# Altium schematic sheet p4_thresolts.SchDoc
size A4
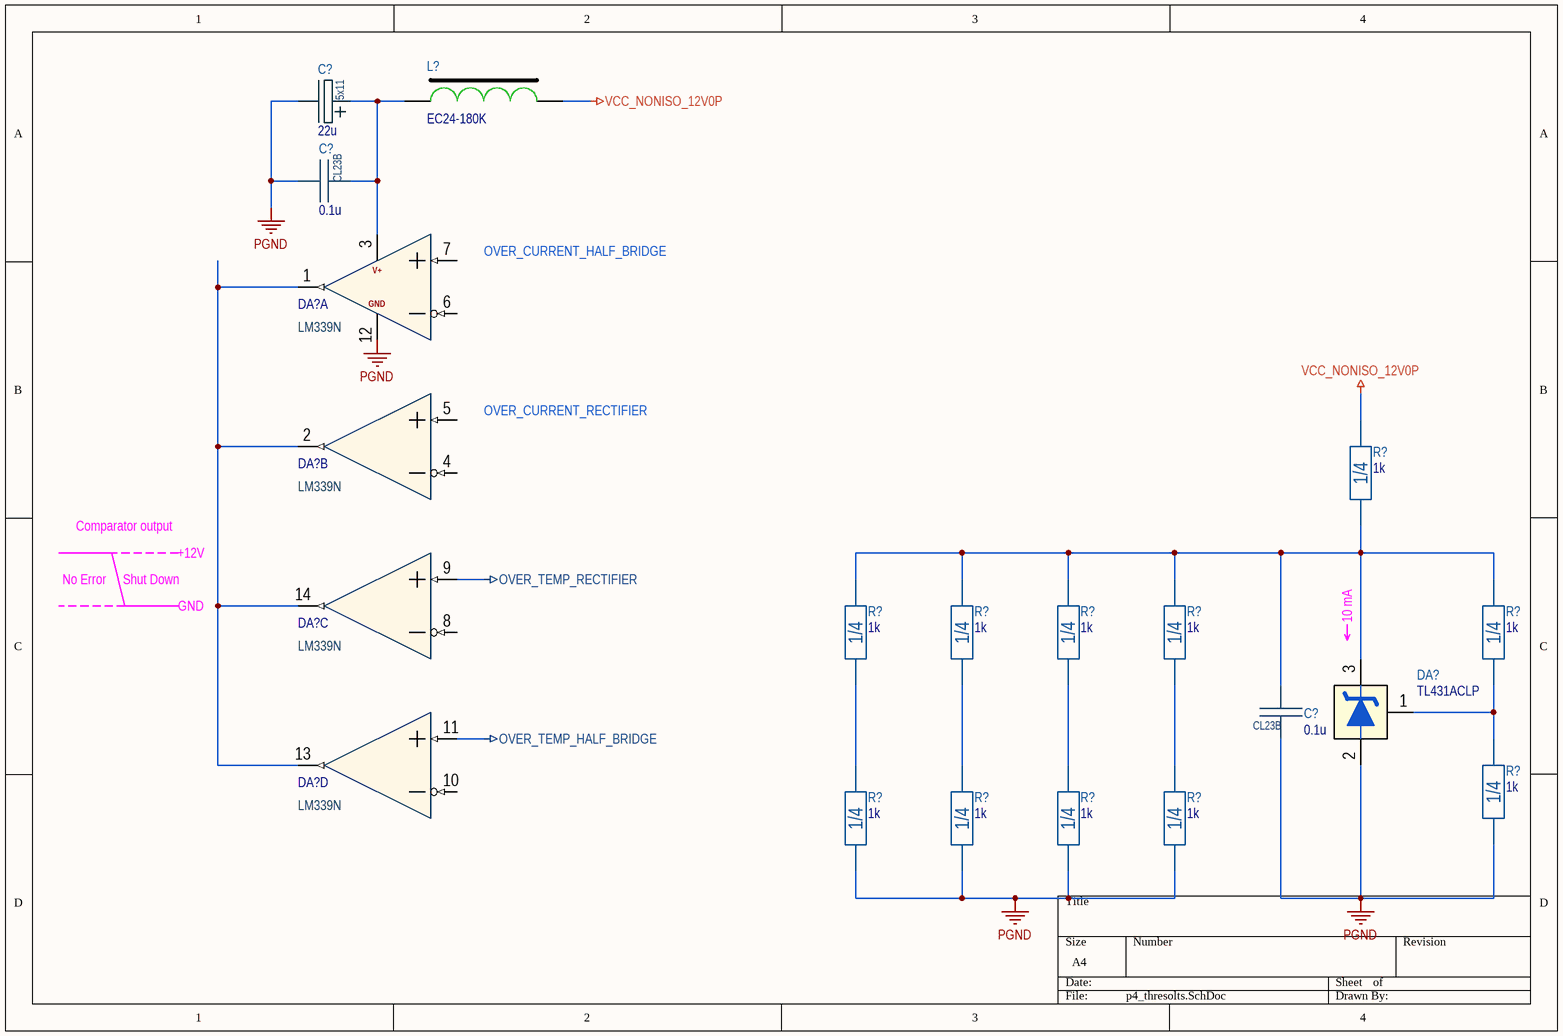
[diagram p0: p4_thresolts.SchDoc]

## Parts
(Parts that share a designator on the sheet are numbered #1, #2 ... from top to bottom, then left to right.)
C?#1  22u  Package: 5x11  [ECAP5X11X2.0_BRW]
C?#2  0.1u  [CL23B_7.2x2.5]
C?#3  0.1u  [CL23B_7.2x2.5]
DA?#1  LM339N  [DIP-14P-M02]  (part A of 4)
DA?#2  LM339N  [DIP-14P-M02]  (part B of 4)
DA?#3  LM339N  [DIP-14P-M02]  (part C of 4)
DA?#4  TL431ACLP  [TO-92 (VERTICAL,LINE)]
DA?#5  LM339N  [DIP-14P-M02]  (part D of 4)
L?  EC24-180K  [EC24_GREEN]
R?#1  1k  Package: 1/4  [CFR-25]
R?#2  1k  Package: 1/4  [CFR-25]
R?#3  1k  Package: 1/4  [CFR-25]
R?#4  1k  Package: 1/4  [CFR-25]
R?#5  1k  Package: 1/4  [CFR-25]
R?#6  1k  Package: 1/4  [CFR-25]
R?#7  1k  Package: 1/4  [CFR-25]
R?#8  1k  Package: 1/4  [CFR-25]
R?#9  1k  Package: 1/4  [CFR-25]
R?#10  1k  Package: 1/4  [CFR-25]
R?#11  1k  Package: 1/4  [CFR-25]

## Nets
OVER_TEMP_HALF_BRIDGE: DA?#5.11(4IN+)
OVER_TEMP_RECTIFIER: DA?#3.9(3IN+)
PGND: C?#1.2 C?#2.2 C?#3.2 DA?#1.12(GND) DA?#4.2(ANODE) R?#7.1 R?#8.1 R?#9.1 R?#10.1 R?#11.1
VCC_NONISO_12V0P: L?.2 R?#1.2
NetC?#1_1: C?#1.1 C?#2.1 DA?#1.3(VCC) L?.1
NetC?#3_1: C?#3.1 DA?#4.3(CATHODE) R?#1.1 R?#2.2 R?#3.2 R?#4.2 R?#5.2 R?#6.2
NetDA?#1_1: DA?#1.1(1OUT) DA?#2.2(2OUT) DA?#3.14(3OUT) DA?#5.13(4OUT)
NetDA?#4_1: DA?#4.1(REF) R?#6.1 R?#7.2
NetR?#2_1: R?#2.1 R?#8.2
NetR?#3_1: R?#3.1 R?#9.2
NetR?#4_1: R?#4.1 R?#10.2
NetR?#5_1: R?#5.1 R?#11.2

Not connected (* = marked no-connect by the designer): DA?#1 6(1IN-) 7(1IN+); DA?#2 4(2IN-) 5(2IN+); DA?#3 8(3IN-); DA?#5 10(4IN-)

## Notes on the sheet
- No Error
- Comparator output
- Shut Down
- +12V
- GND
- 10 mA
- Labels drawn without touching a wire or pin: OVER_CURRENT_HALF_BRIDGE, OVER_CURRENT_RECTIFIER
- (in symbol LM339N, part A) V+

## Library data of the parts
C?#1 = C_ECAP: Aluminium capacitor; Part Number: UVR1J220MDD; Manufacturer: Nichicon; Tolerance: ± 20 %; Voltage: 63V; Value: 22u; Value on schem: 22u
C?#2 C?#3 = CL23B: Box-type metallized polyester film capacitor; Tolerance: ± * %; Voltage: 63V; Value: 0.1u; Dielectric: Polyester; Value on schem: 0.1u; Part Number: *; Manufacturer: *; Package: CL23B
DA?#1-DA?#3 DA?#5 = LM339N: Quad Comparators; Manufacturer: Texas Instruments; Part Number: LM339N; Package: DIP-14
DA?#4 = TL431ACLP: Precision Programmable Reference; Manufacturer: Texas Instruments; Part Number: TL431ACLP; Package: TO-92
L? = EC24: Axial leaded coated inductors; Manufacturer: 3L Electronic; RDC: 1 Ohm; SRF Min: 15 MHz; Q: 40; Irms  Max: 315 mA; Inductance @ 100 kHz: 18 µH; Part Number: EC24-180K; Package: EC24
R?#1-R?#11 = CF25: Resistor 1/4W; Part Number: MFR-25FTF52-1K; Manufacturer: Yageo; Tolerance: ± 1 %; Voltage: 250V; Temperature Coefficient: ±100 ppm/°C; Value: 1k; Value on schem: 1k